# Altium project PCB_Project2.PrjPCB
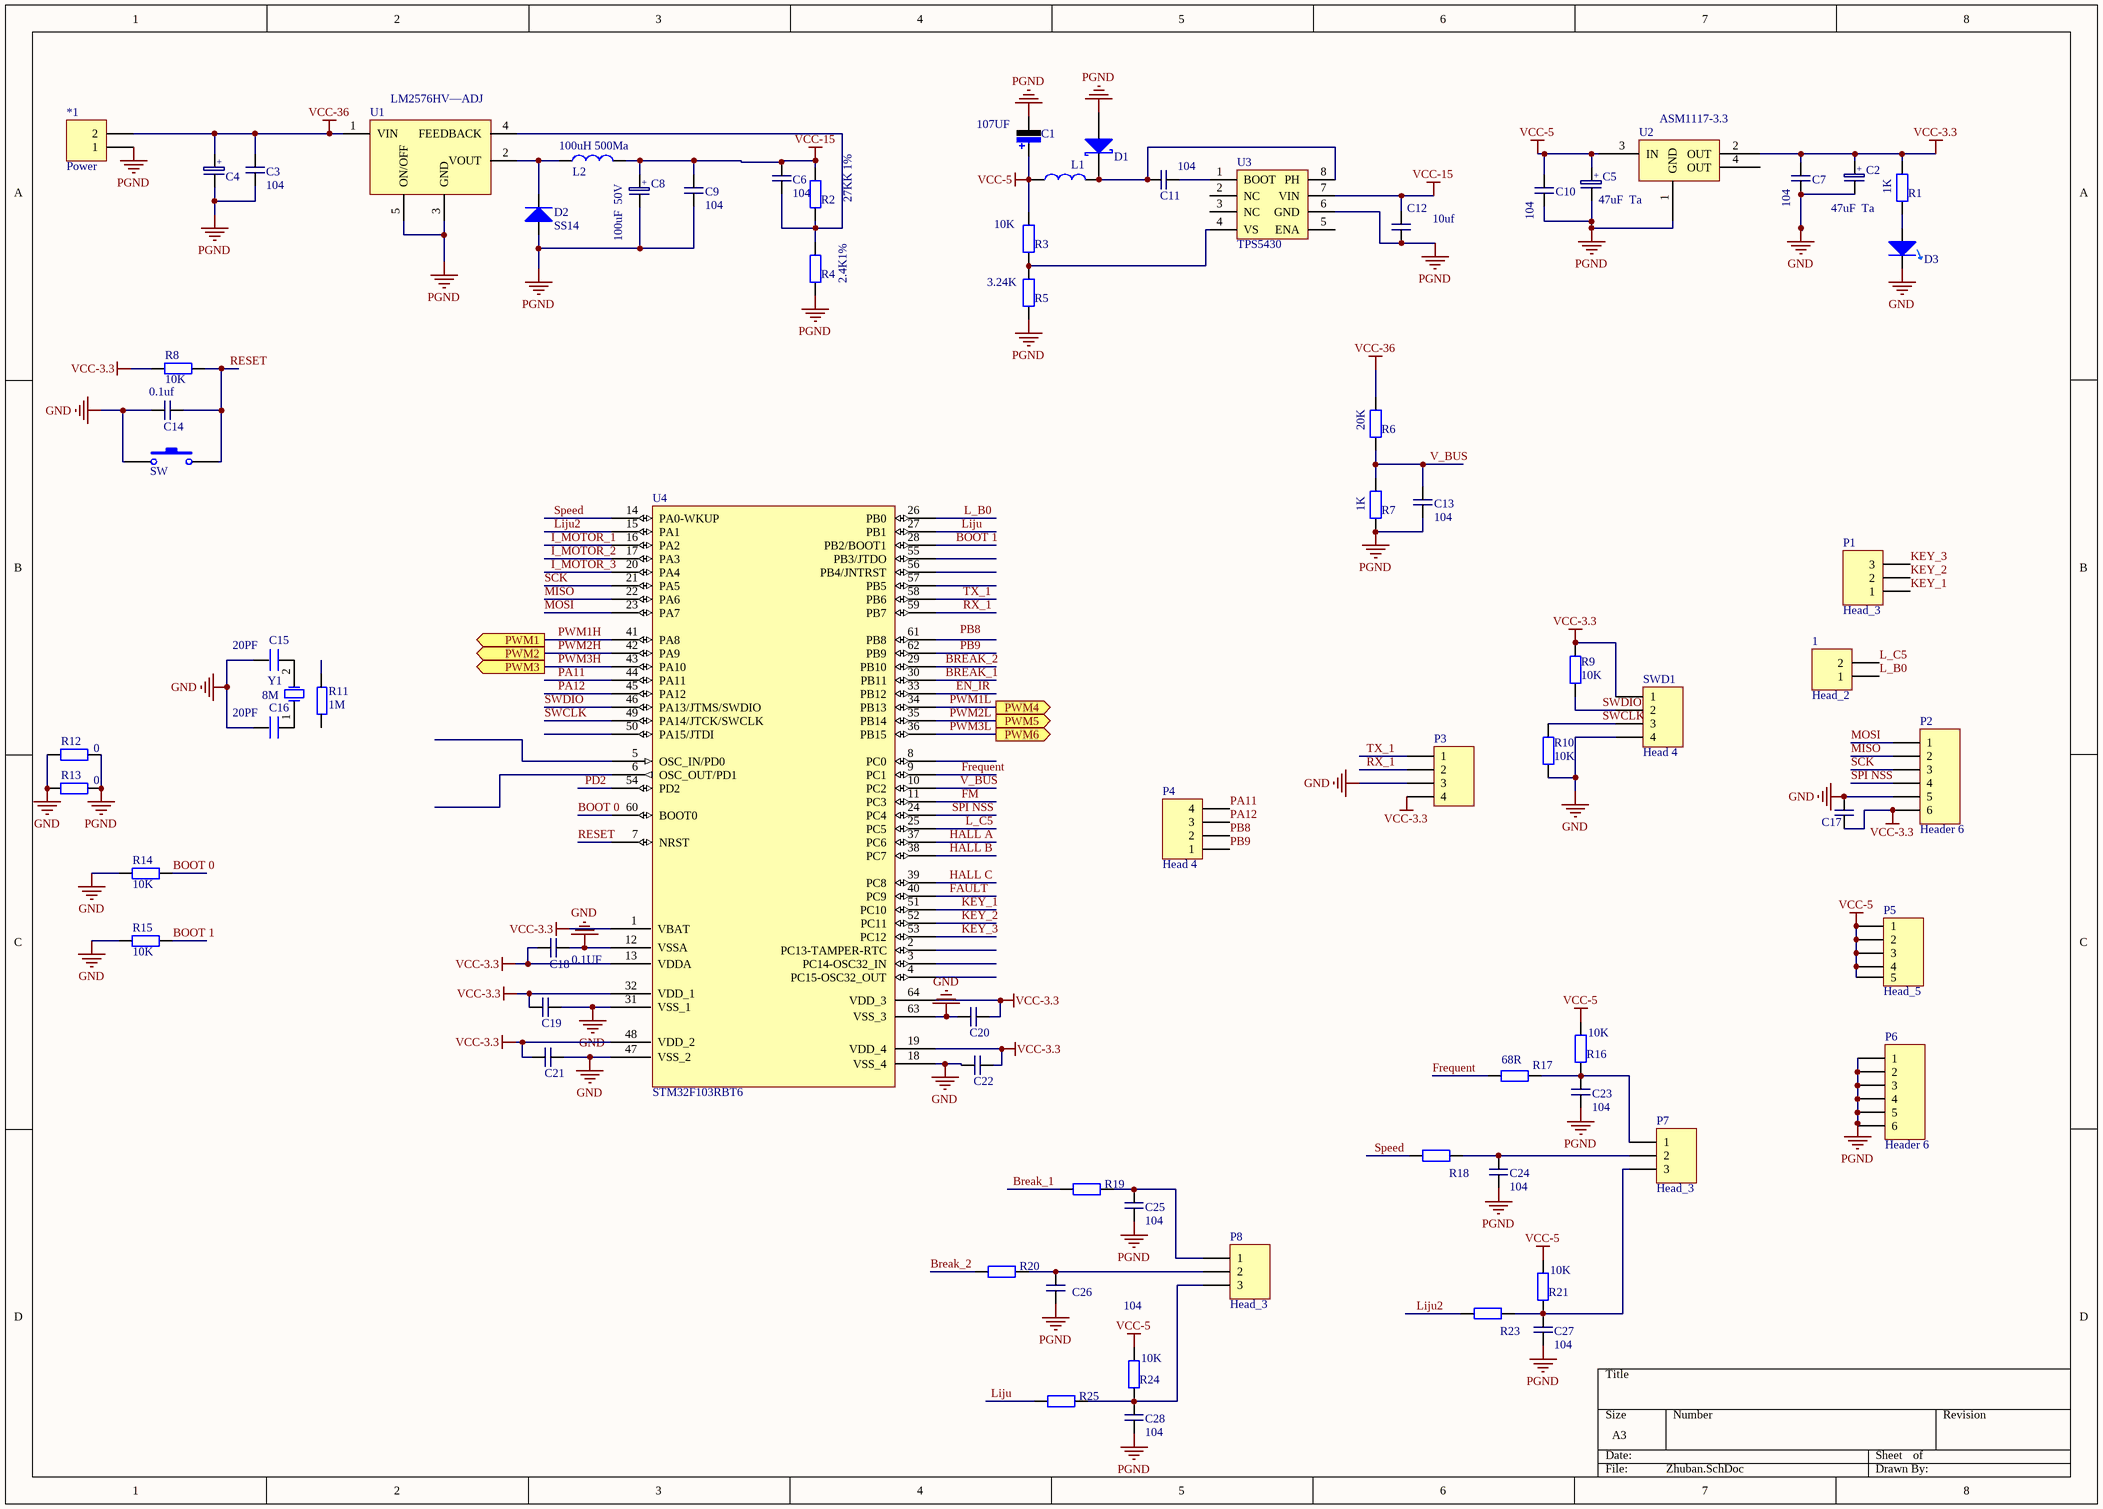
[diagram p0: Zhuban.SchDoc]
2 sheets, 135 parts. Net scope: global (net labels, ports and power ports of the same name join across sheets).
Board file: PCB1.PcbDoc
Sheets:
  Zhuban.SchDoc
  Drive.SchDoc

## Sheet Zhuban.SchDoc
size A3; PageSetup: Record=PageOptions|CenterHorizontal=True|CenterVertical=True|PrintScale=1.04|XCorrection=1.00|YCorrection=1.00|PrintKind=0|BorderSize=5000000|LeftOffset=0|BottomOffset=0|Orientation=2|PaperLength=1000|PaperWidth=1000|Scale=100|PaperSource=7|PrintQuality=-4|MediaType=1|DitherType=10|PaperKind=A3|PrintScaleMode=1

### Parts
1  Head_2  [HDR1X2]
*1  Power  [普通二口接线柱]
*2  SW  [KEY]
C1  107UF  [6032C  TA]
C2  47uF  Ta  [3216A  Ta]
C3  104  [0805C]
C4  330uF 63V  [Cap  电解  10mm]  (value not drawn)
C5  47uF  Ta  [3216A  Ta]
C6  104  [0603- C]
C7  104  [0603- C]
C8  100uF  50V  [Cap  电解  8mm - duplicate]
C9  104  [0603- C]
C10  104  [0603- C]
C11  104  [0603- C]
C12  10uf  [0805C]
C13  104  [0603- C]
C14  0.1uf  [0603- C]
C15  20PF  [0603- C]
C16  20PF  [0603- C]
C17  Cap  [0603- C]  (value not drawn)
C18  0.1UF  [0603- C]
C19  Cap  [0603- C]  (value not drawn)
C20  Cap  [0603- C]  (value not drawn)
C21  Cap  [0603- C]  (value not drawn)
C22  Cap  [0603- C]  (value not drawn)
C23  104  [0603- C]
C24  104  [0603- C]
C25  104  [0603- C]
C26  104  [0603- C]
C27  104  [0603- C]
C28  104  [0603- C]
D1  D  [D RS1M]  (value not drawn)
D2  SS14  [D RS1M]
D3  D_2  [0805D]  (value not drawn)
L1  L  [CD_54]  (value not drawn)
L2  100uH 500Ma  [L  电感  6mm]
P1  Head_3  [HDR1X3]
P2  Header 6  [HDR1X6- duplicate]
P3  (no value)  [HDR1X4]
P4  Head 4  [HDR1X4]
P5  Head_5  [HDR1X5]
P6  Header 6  [HDR1X6]
P7  Head_3  [HDR1X3]
P8  Head_3  [HDR1X3]
R1  1K  [0603-R]
R2  27KK 1%  [0805R]
R3  10K  [0603-R]
R4  2.4K1%  [0805R]
R5  3.24K  [0603-R]
R6  20K  [0805R]
R7  1K  [0805R]
R8  10K  [0603-R]
R9  10K  [0603-R]
R10  10K  [0603-R]
R11  1M  [0603-R]
R12  0  [0603-R]
R13  0  [0603-R]
R14  10K  [0603-R]
R15  10K  [0603-R]
R16  10K  [0603-R]
R17  68R  [0603-R]
R18  68R  [0603-R]  (value not drawn)
R19  68R  [0603-R]  (value not drawn)
R20  68R  [0603-R]  (value not drawn)
R21  10K  [0603-R]
R23  68R  [0603-R]  (value not drawn)
R24  10K  [0603-R]
R25  68R  [0603-R]  (value not drawn)
SWD1  Head 4  [HDR1X4]
U1  LM2576HV—ADJ  [LM]
U2  ASM1117-3.3  [AMS1117]
U3  TPS5430  [SOIC-8piN]
U4  STM32F103RBT6  [LQFP64]
Y1  8M  [OSC-5032]

### Ports
PWM1 (out), PWM2 (out), PWM3 (out), PWM4 (out), PWM5 (out), PWM6 (out)

### Nets
GND: *2.1 C2.2 C7.2 C14.2 C15.1 C16.1 C17.1 C18.2 C19.2 C20.1 C21.2 C22.1 D3.K P2.5 P3.3 R10.1 R12.2 R13.2 R14.2 R15.2 SWD1.4 U4.12(VSSA) U4.18(VSS_4) U4.31(VSS_1) U4.47(VSS_2) U4.63(VSS_3)
PGND: *1.1 C1.2 C3.2 C4.2 C5.2 C8.2 C9.2 C10.2 C12.1 C13.2 C23.1 C24.1 C25.1 C26.1 C27.1 C28.1 D1.A D2.A P6.1 P6.2 P6.3 P6.4 P6.5 P6.6 R4.1 R5.2 R7.1 R12.1 R13.1 U1.3(GND) U1.5(ON/OFF) U2.1(GND) U3.6(GND)
VCC-3.3: C2.1 C7.1 C17.2 C18.1 C19.1 C20.2 C21.1 C22.2 P2.6 P3.4 R1.2 R8.2 R9.2 SWD1.1 U2.2(OUT) U4.1(VBAT) U4.13(VDDA) U4.19(VDD_4) U4.32(VDD_1) U4.48(VDD_2) U4.64(VDD_3)
VCC-5: C1.1 C5.1 C10.1 L1.2 P5.1 P5.2 P5.3 P5.4 P5.5 R3.2 R16.2 R21.2 R24.2 U2.3(IN)
VCC-15: C6.1 C8.1 C9.1 C12.2 L2.1 R2.2 U3.7(VIN)
VCC-36: *1.2 C3.1 C4.1 R6.2 U1.1(VIN)
BOOT 0: R14.1 U4.60(BOOT0)
BOOT 1: R15.1 U4.28(PB2/BOOT1)
BREAK_1: R19.2 U4.30(PB11)
BREAK_2: R20.2 U4.29(PB10)
EN_IR: U4.33(PB12)
FAULT: U4.40(PC9)
FM: U4.11(PC3)
Frequent: R17.2 U4.9(PC1)
HALL A: U4.37(PC6)
HALL B: U4.38(PC7)
HALL C: U4.39(PC8)
I_MOTOR_1: U4.16(PA2)
I_MOTOR_2: U4.17(PA3)
I_MOTOR_3: U4.20(PA4)
KEY_1: P1.1 U4.51(PC10)
KEY_2: P1.2 U4.52(PC11)
KEY_3: P1.3 U4.53(PC12)
L_B0: 1.1 U4.26(PB0)
L_C5: 1.2 U4.25(PC5)
Liju: R25.2 U4.27(PB1)
Liju2: R23.2 U4.15(PA1)
MISO: P2.2 U4.22(PA6)
MOSI: P2.1 U4.23(PA7)
PA11: P4.4 U4.44(PA11)
PA12: P4.3 U4.45(PA12)
PB8: P4.2
PB9: P4.1 U4.62(PB9)
PD2: U4.54(PD2)
PWM1H: U4.41(PA8) ; port PWM1
PWM1L: U4.34(PB13) ; port PWM4
PWM2H: U4.42(PA9) ; port PWM2
PWM2L: U4.35(PB14) ; port PWM5
PWM3H: U4.43(PA10) ; port PWM3
PWM3L: U4.36(PB15) ; port PWM6
RESET: *2.2 C14.1 R8.1 U4.7(NRST)
RX_1: P3.2 U4.59(PB7)
SCK: P2.3 U4.21(PA5)
Speed: R18.2 U4.14(PA0-WKUP)
SPI NSS: P2.4 U4.24(PC4)
SWCLK: R10.2 SWD1.3 U4.49(PA14/JTCK/SWCLK)
SWDIO: R9.1 SWD1.2 U4.46(PA13/JTMS/SWDIO)
TX_1: P3.1 U4.58(PB6)
V_BUS: C13.1 R6.1 R7.2 U4.10(PC2)
NetC6_2: C6.2 R2.1 R4.2 U1.4(FEEDBACK)
NetC11_1: C11.1 U3.1(BOOT)
NetC11_2: C11.2 D1.K L1.1 U3.8(PH)
NetC15_2: C15.2 Y1.2(OSC2)
NetC16_2: C16.2 Y1.1(OSC1)
NetC23_2: C23.2 P7.1 R16.1 R17.1
NetC24_2: C24.2 P7.2 R18.1
NetC25_2: C25.2 P8.1 R19.1
NetC26_2: C26.2 P8.2 R20.1
NetC27_2: C27.2 P7.3 R21.1 R23.1
NetC28_2: C28.2 P8.3 R24.1 R25.1
NetD2_K: D2.K L2.2 U1.2(VOUT)
NetD3_A: D3.A R1.1
NetR3_1: R3.1 R5.1 U3.4(VS)

Not connected (* = marked no-connect by the designer): R11 1 2; U2 4(OUT); U3 2(NC) 3(NC) 5(ENA); U4 2(PC13-TAMPER-RTC) 3(PC14-OSC32_IN) 4(PC15-OSC32_OUT) 5(OSC_IN/PD0) 6(OSC_OUT/PD1) 8(PC0) 50(PA15/JTDI) 55(PB3/JTDO) 56(PB4/JNTRST) 57(PB5) 61(PB8)

### Notes on the sheet
- Labels drawn without touching a wire or pin: PB8
- (in symbol Cap_1) +

### Library data of the parts
1 = Head_2  Power
*1 = Head_2
*2 = SW: 开关
C1 = Cap_2: 钽电容
C2 C4 C5 C8 = Cap_1
C3 C6 C7 C9-C14 C18 C23-C28 = Cap
C15 C16 = C
D2 = D_1: 二极管
D3 = D_2: 发光二极管
L1 L2 = L: 电感
P2 = Header 6: 接插件; LatestRevisionDate: 17-Jul-2002; LatestRevisionNote: Re-released for DXP Platform.; Publisher: Altium Limited
P3 P4 SWD1 = Head_4
P6 = Header 6: Header, 6-Pin; LatestRevisionDate: 17-Jul-2002; LatestRevisionNote: Re-released for DXP Platform.; Publisher: Altium Limited
R1-R8 R11-R21 R23-R25 = R
R9 R10 = R: 510
U2 = ASM1117-3.3: 3.3 稳压
Y1 = C-Osc: Crystal Oscillator; Published: 8-Jun-2000; LatestRevisionDate: 17-Jul-2002; LatestRevisionNote: Re-released for DXP Platform.; PackageReference: R38; Publisher: Altium Limited; PackageDescription: Crystal, Thru-Hole; 2 Leads; Body 3.1 x 8.2 mm (Dia.xH)

## Sheet Drive.SchDoc
size A3; PageSetup: Record=PageOptions|CenterHorizontal=True|CenterVertical=True|PrintScale=1.00|XCorrection=1.00|YCorrection=1.00|PrintKind=0|BorderSize=5000000|LeftOffset=0|BottomOffset=0|Orientation=2|PaperLength=1000|PaperWidth=1000|Scale=100|PaperSource=7|PrintQuality=-4|MediaType=1|DitherType=10|PaperKind=A3|PrintScaleMode=1
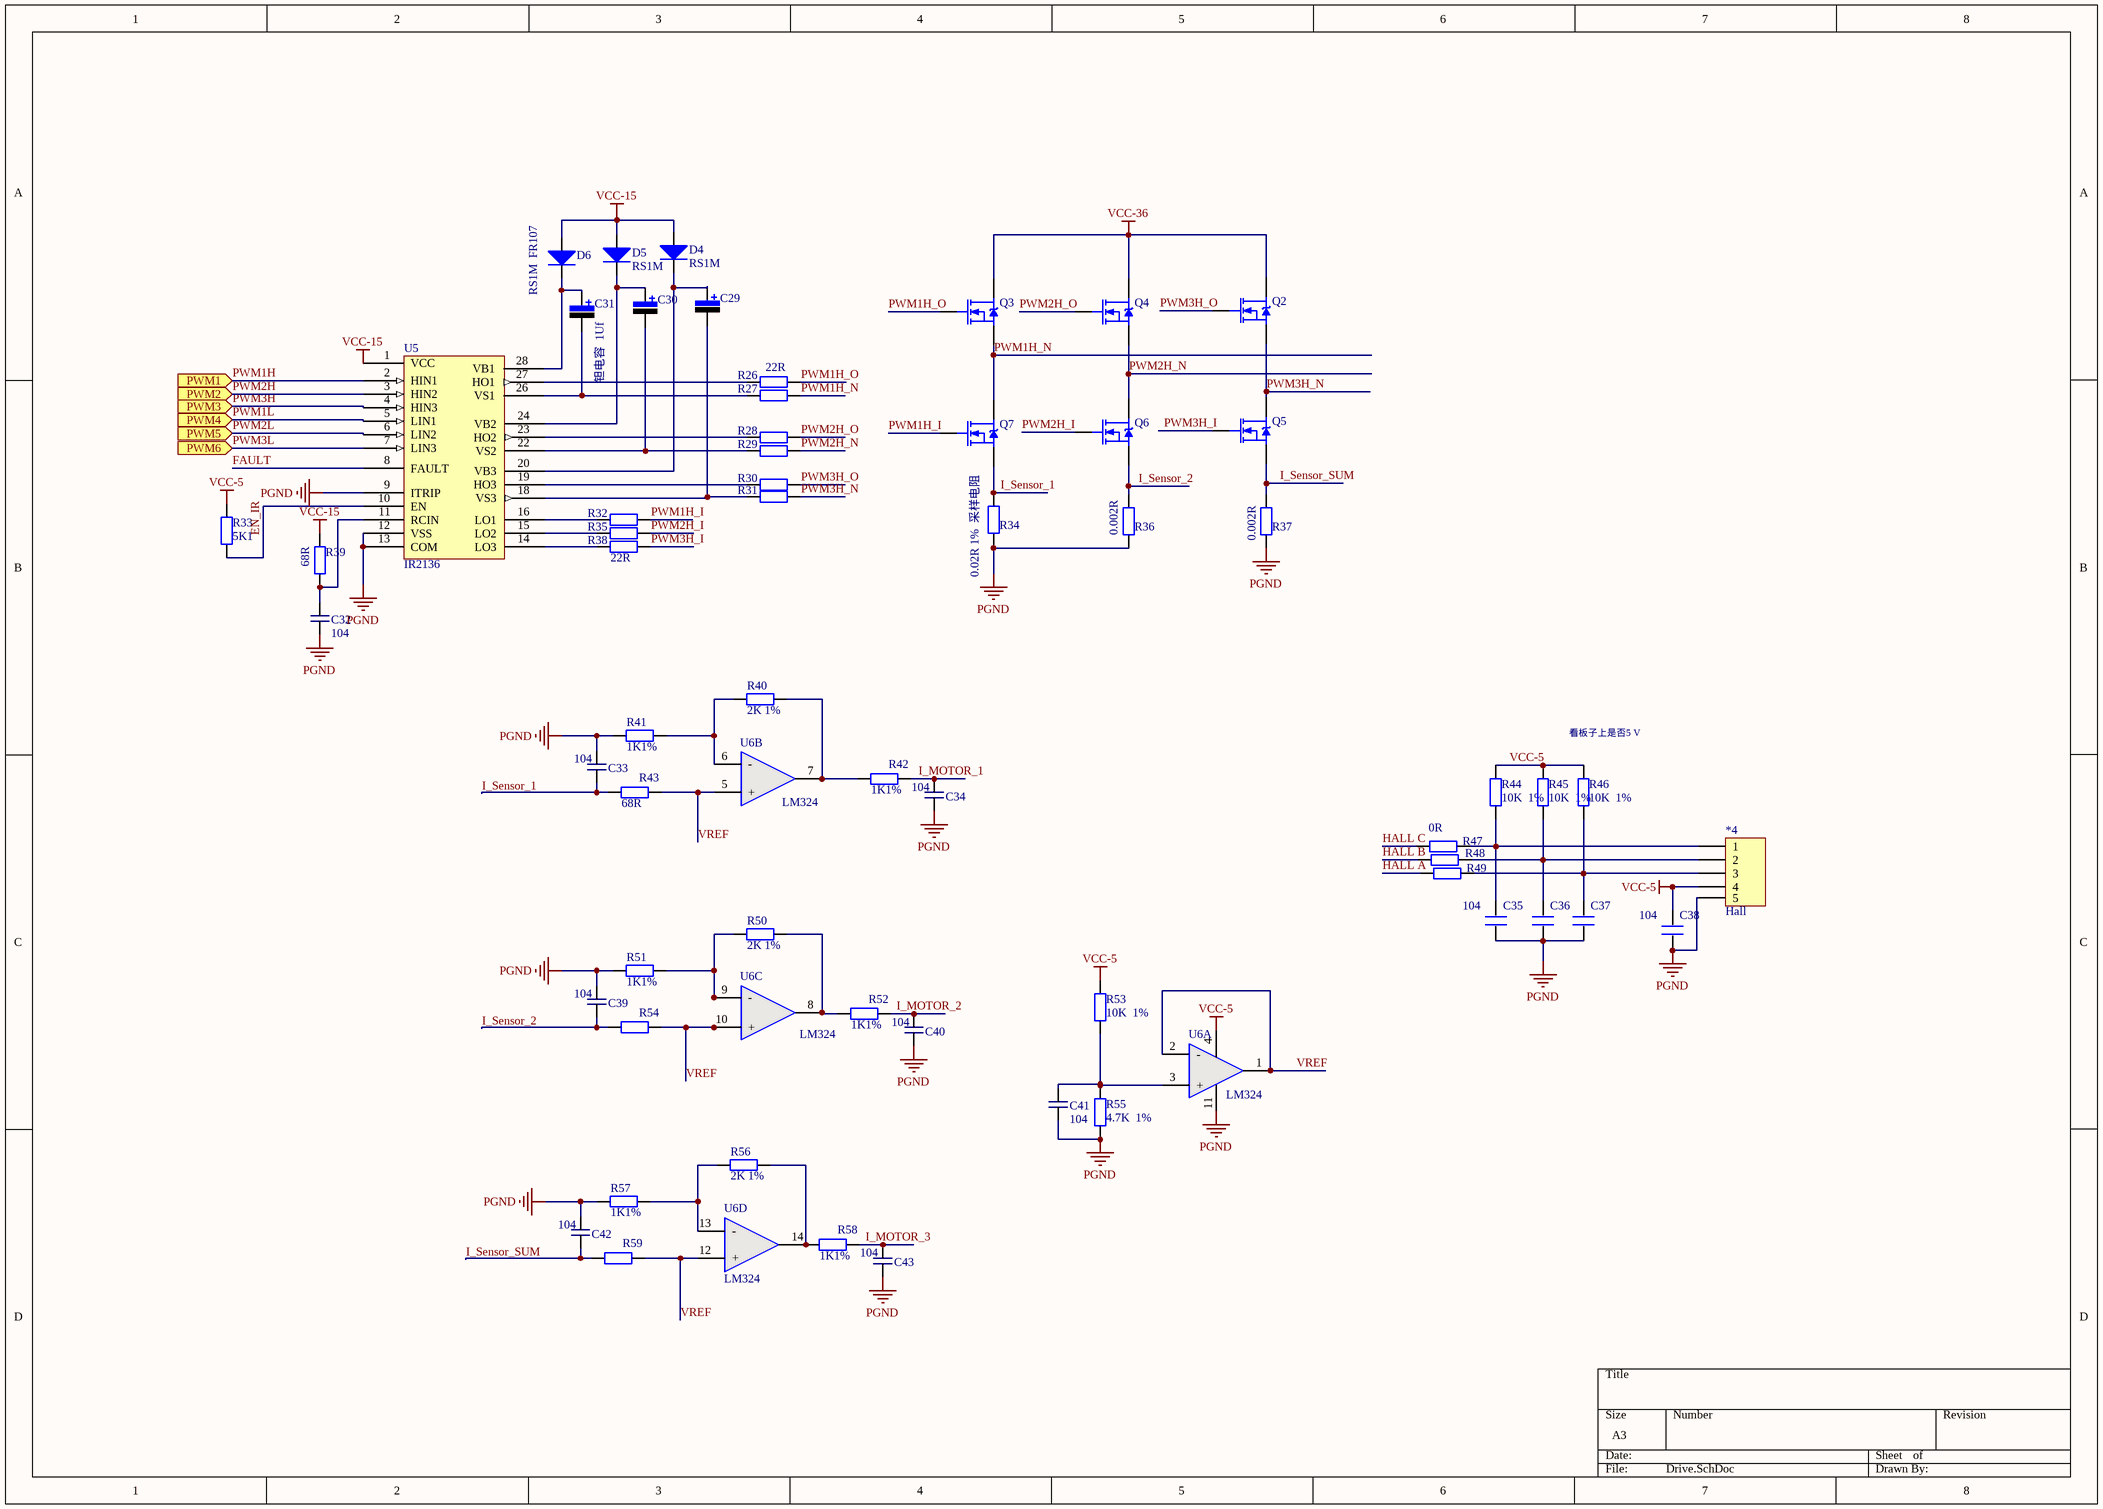
[diagram p1: Drive.SchDoc]

### Parts
*4  Hall  [普通五口接线柱]
C29  钽电容  [3216A  Ta]  (value not drawn)
C30  钽电容  [3216A  Ta]  (value not drawn)
C31  钽电容  1Uf  [3216A  Ta]
C32  104  [0603- C]
C33  104  [0603- C]
C34  104  [0603- C]
C35  104  [0603- C]
C36  104  [0603- C]  (value not drawn)
C37  104  [0603- C]  (value not drawn)
C38  104  [0603- C]
C39  104  [0603- C]
C40  104  [0603- C]
C41  104  [0603- C]
C42  104  [0603- C]
C43  104  [0603- C]
D4  RS1M  [D RS1M]
D5  RS1M  [D RS1M]
D6  RS1M  FR107  [D RS1M]
Q2  IRF540NS  [TO-220AB  MOS]  (value not drawn)
Q3  IRF540NS  [TO-220AB  MOS]  (value not drawn)
Q4  IRF540NS  [TO-220AB  MOS]  (value not drawn)
Q5  IRF540NS  [TO-220AB  MOS]  (value not drawn)
Q6  IRF540NS  [TO-220AB  MOS]  (value not drawn)
Q7  IRF540NS  [TO-220AB  MOS]  (value not drawn)
R26  22R  [0805R]
R27  68R  [0805R]  (value not drawn)
R28  68R  [0805R]  (value not drawn)
R29  68R  [0805R]  (value not drawn)
R30  68R  [0805R]  (value not drawn)
R31  68R  [0805R]  (value not drawn)
R32  68R  [0805R]  (value not drawn)
R33  5K1  [0603-R]
R34  0.02R 1%  采样电阻  [2512R]
R35  68R  [0805R]  (value not drawn)
R36  0.002R  [2512R]
R37  0.002R  [2512R]
R38  22R  [0805R]
R39  68R  [0603-R]
R40  2K 1%  [0603-R]
R41  1K1%  [0603-R]
R42  1K1%  [0603-R]
R43  68R  [0603-R]
R44  10K  1%  [0603-R]
R45  10K  1%  [0603-R]
R46  10K  1%  [0603-R]
R47  0R  [0603-R]
R48  R  [0603-R]  (value not drawn)
R49  R  [0603-R]  (value not drawn)
R50  2K 1%  [0603-R]
R51  1K1%  [0603-R]
R52  1K1%  [0603-R]
R53  10K  1%  [0603-R]
R54  1K1%  [0603-R]  (value not drawn)
R55  4.7K  1%  [0603-R]
R56  2K 1%  [0603-R]
R57  1K1%  [0603-R]
R58  1K1%  [0603-R]
R59  1K1%  [0603-R]  (value not drawn)
U5  IR2136  [IR2136S SOIC-28]
U6  LM324  [SOP-14N]  (parts A,B,C,D of 4)

### Ports
PWM1 (in), PWM2 (in), PWM3 (in), PWM4 (in), PWM5 (in), PWM6 (in)

### Nets
PGND: *4.5 C32.2 C33.1 C34.2 C35.1 C36.1 C37.1 C38.1 C39.1 C40.2 C41.2 C42.1 C43.2 R34.1 R36.1 R37.1 R41.2 R51.2 R55.2 R57.2 U5.9(ITRIP) U5.12(VSS) U5.13(COM) U6.11(V-)
VCC-5: *4.4 C38.2 R33.1 R44.1 R45.1 R46.1 R53.1 U6.4(V+)
VCC-15: D4.A D5.A D6.A R39.1 U5.1(VCC)
VCC-36: Q2.D Q3.D Q4.D
EN_IR: R33.2 U5.10(EN)
FAULT: U5.8(FAULT)
HALL A: R49.1
HALL B: R48.1
HALL C: R47.1
I_MOTOR_1: C34.1 R42.1
I_MOTOR_2: C40.1 R52.1
I_MOTOR_3: C43.1 R58.1
I_Sensor_1: C33.2 Q7.S R34.2 R43.2
I_Sensor_2: C39.2 Q6.S R36.2 R54.2
I_Sensor_SUM: C42.2 Q5.S R37.2 R59.2
PWM1H: U5.2(HIN1) ; port PWM1
PWM1H_I: Q7.G R32.2
PWM1H_N: Q3.S Q7.D R27.2
PWM1H_O: Q3.G R26.2
PWM1L: U5.5(LIN1) ; port PWM4
PWM2H: U5.3(HIN2) ; port PWM2
PWM2H_I: Q6.G R35.2
PWM2H_N: Q4.S Q6.D R29.2
PWM2H_O: Q4.G R28.2
PWM2L: U5.6(LIN2) ; port PWM5
PWM3H: U5.4(HIN3) ; port PWM3
PWM3H_I: Q5.G R38.2
PWM3H_N: Q2.S Q5.D R31.2
PWM3H_O: Q2.G R30.2
PWM3L: U5.7(LIN3) ; port PWM6
VREF: R43.1 R54.1 R59.1 U6.1(OUT) U6.2(-) U6.5(+) U6.10(+) U6.12(+)
Net*4_1: *4.1 C35.2 R44.2 R47.2
Net*4_2: *4.2 C36.2 R45.2 R48.2
Net*4_3: *4.3 C37.2 R46.2 R49.2
NetC29_1: C29.1 D4.K U5.20(VB3)
NetC29_2: C29.2 R31.1 U5.18(VS3)
NetC30_1: C30.1 D5.K U5.24(VB2)
NetC30_2: C30.2 R29.1 U5.22(VS2)
NetC31_1: C31.1 D6.K U5.28(VB1)
NetC31_2: C31.2 R27.1 U5.26(VS1)
NetC32_1: C32.1 R39.2 U5.11(RCIN)
NetC41_1: C41.1 R53.2 R55.1 U6.3(+)
NetR26_1: R26.1 U5.27(HO1)
NetR28_1: R28.1 U5.23(HO2)
NetR30_1: R30.1 U5.19(HO3)
NetR32_1: R32.1 U5.16(LO1)
NetR35_1: R35.1 U5.15(LO2)
NetR38_1: R38.1 U5.14(LO3)
NetR40_1: R40.1 R42.2 U6.7(OUT)
NetR40_2: R40.2 R41.1 U6.6(-)
NetR50_1: R50.1 R52.2 U6.8(OUT)
NetR50_2: R50.2 R51.1 U6.9(-)
NetR56_1: R56.1 R58.2 U6.14(OUT)
NetR56_2: R56.2 R57.1 U6.13(-)

### Notes on the sheet
- 看板子上是否5 V

### Library data of the parts
*4 = Head_5
C29 C30 = Cap_2
C31 = Cap_2: 钽电容
C32-C34 C39-C43 = Cap
C35-C38 = C
D4-D6 = D_1: 二极管
Q2-Q7 = IRF540NS: MOS
R26-R47 R50-R59 = R
U6 = LM324: 4运放SOP8芯片

## Nets that join several sheets
PGND: Zhuban (33 pins), Drive (24 pins)
VCC-5: Zhuban (14 pins), Drive (8 pins)
VCC-15: Zhuban (7 pins), Drive (5 pins)
VCC-36: Zhuban (5 pins), Drive (Q2.D Q3.D Q4.D)
EN_IR: Zhuban (U4.33), Drive (R33.2 U5.10)
FAULT: Zhuban (U4.40), Drive (U5.8)
HALL A: Zhuban (U4.37), Drive (R49.1)
HALL B: Zhuban (U4.38), Drive (R48.1)
HALL C: Zhuban (U4.39), Drive (R47.1)
I_MOTOR_1: Zhuban (U4.16), Drive (C34.1 R42.1)
I_MOTOR_2: Zhuban (U4.17), Drive (C40.1 R52.1)
I_MOTOR_3: Zhuban (U4.20), Drive (C43.1 R58.1)
PWM1H: Zhuban (U4.41), Drive (U5.2)
PWM1L: Zhuban (U4.34), Drive (U5.5)
PWM2H: Zhuban (U4.42), Drive (U5.3)
PWM2L: Zhuban (U4.35), Drive (U5.6)
PWM3H: Zhuban (U4.43), Drive (U5.4)
PWM3L: Zhuban (U4.36), Drive (U5.7)